# Altium project PCB_4550_Project.PrjPCB
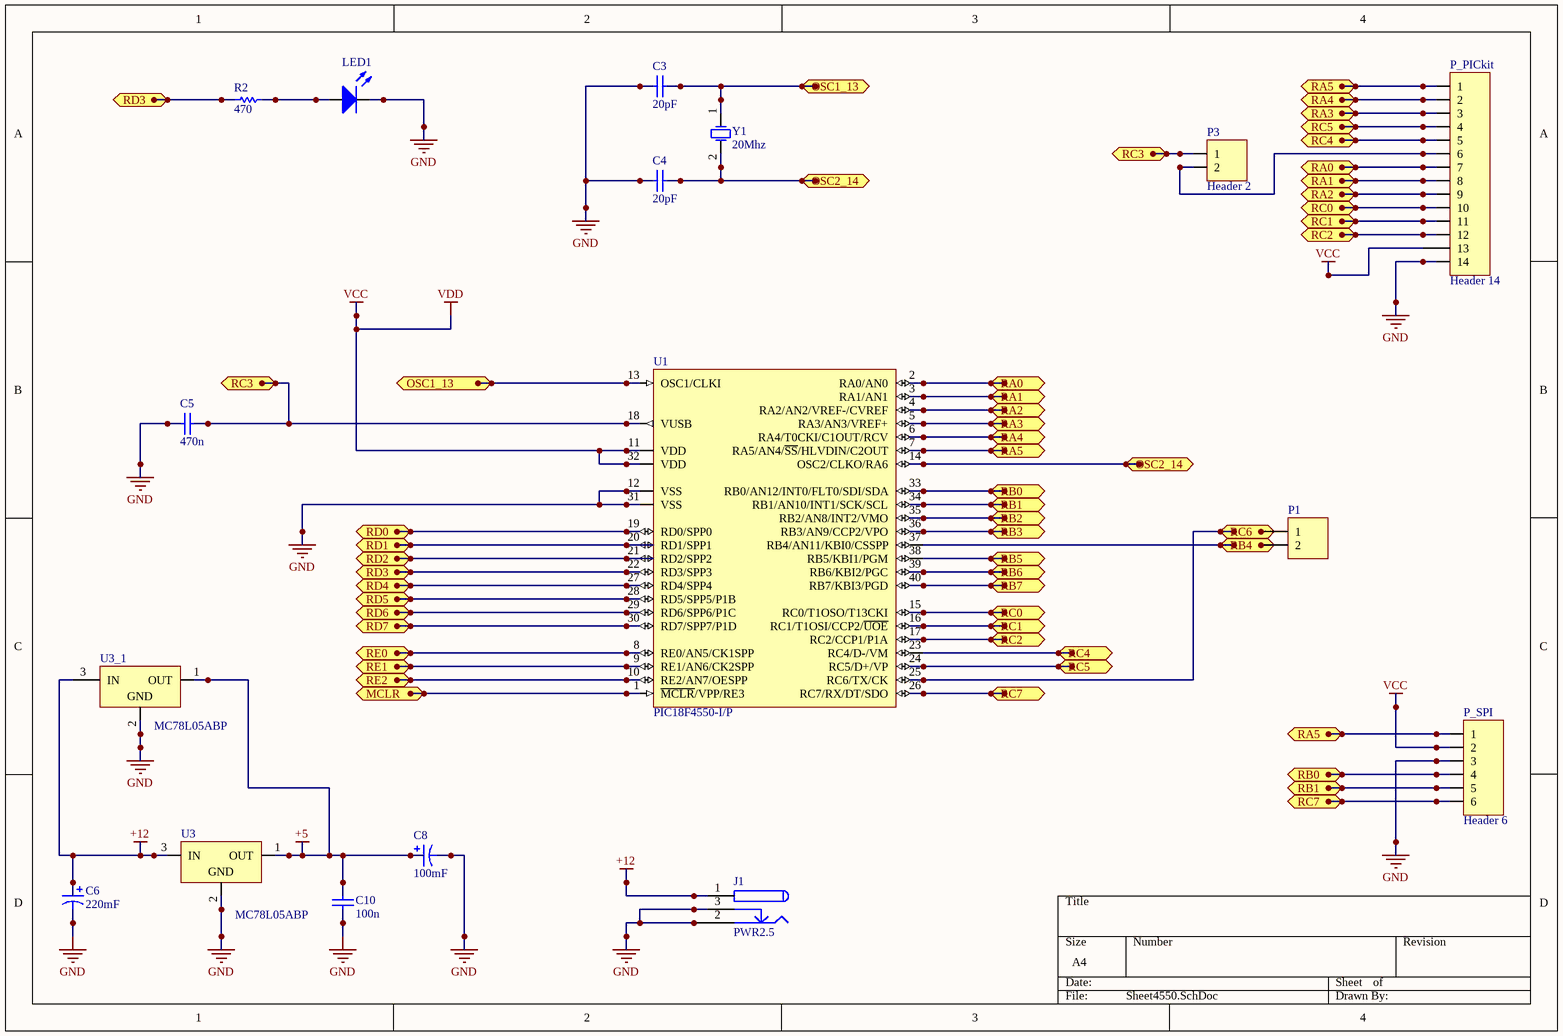
[diagram p0: Sheet4550.SchDoc]
1 sheet, 17 parts. Net scope: flat (ports and power ports of the same name join across sheets).
Board file: PCB_4550.PcbDoc

## Sheet Sheet4550.SchDoc
size A4

### Parts
C3  20pF  [CAPC2012L]
C4  20pF  [CAPC2012L]
C5  470n  [CAPC2012L]
C6  220mF  [CAPPR5-10x12.5]
C8  100mF  [CAPC5764L]
C10  100n  [CAPC2012L]
J1  PWR2.5  [KLD-0202]
LED1  LED2  [CAPC2012L]  (value not drawn)
P1  Header 2  [HDR1X2]  (value not drawn)
P3  Header 2  [HDR1X2]
P_PICkit  Header 14  [HDR1X14]
P_SPI  Header 6  [HDR1X6]
R2  470  [RESC3216L]
U1  PIC18F4550-I/P  [PDIP600-P40]
U3  MC78L05ABP  [29-04]
U3_1  MC78L05ABP  [29-04]
Y1  20Mhz  [SPST-2]

### Ports
MCLR, OSC1_13, OSC2_14, OSC2_14 (bidir), RA0, RA1, RA2, RA3, RA4, RA5, RB0, RB1, RB2, RB3, RB4, RB5, RB6, RB7, RC0, RC1, RC2, RC3, RC4, RC5, RC6, RC7, RD0, RD1, RD2, RD3, RD4, RD5, RD6, RD7, RE0, RE1, RE2

### Nets
+5: C8.1 C10.2 U3.1(OUT) U3_1.1(OUT)
+12: C6.1 J1.1 J1.1A J1.1B U3.3(IN) U3_1.3(IN)
GND: C3.1 C4.1 C5.1 C6.2 C8.2 C10.1 J1.2 J1.2A J1.2B J1.3 J1.3A J1.3B LED1.2(K) P_PICkit.14 P_SPI.3 U1.12(VSS) U1.31(VSS) U3.2(GND) U3_1.2(GND)
VCC: P_PICkit.13 P_SPI.2 U1.11(VDD) U1.32(VDD)  [also labelled VDD]
NetC3_2: C3.2 U1.13(OSC1/CLKI) Y1.1(OSC1) ; port OSC1_13
NetC4_2: C4.2 U1.14(OSC2/CLKO/RA6) Y1.2(OSC2) ; port OSC2_14
NetC5_2: C5.2 P3.1 U1.18(VUSB) ; port RC3
NetLED1_1: LED1.1(A) R2.2
NetP3_2: P3.2 P_PICkit.6
NetP_PICkit_1: P_PICkit.1 P_SPI.1 U1.7(RA5/AN4/~{SS}/HLVDIN/C2OUT) ; port RA5
NetP_PICkit_2: P_PICkit.2 U1.6(RA4/T0CKI/C1OUT/RCV) ; port RA4
NetP_PICkit_3: P_PICkit.3 U1.5(RA3/AN3/VREF+) ; port RA3
NetP_PICkit_4: P_PICkit.4 U1.24(RC5/D+/VP) ; port RC5
NetP_PICkit_5: P_PICkit.5 U1.23(RC4/D-/VM) ; port RC4
NetP_PICkit_7: P_PICkit.7 U1.2(RA0/AN0) ; port RA0
NetP_PICkit_8: P_PICkit.8 U1.3(RA1/AN1) ; port RA1
NetP_PICkit_9: P_PICkit.9 U1.4(RA2/AN2/VREF-/CVREF) ; port RA2
NetP_PICkit_10: P_PICkit.10 U1.15(RC0/T1OSO/T13CKI) ; port RC0
NetP_PICkit_11: P_PICkit.11 U1.16(RC1/T1OSI/CCP2/~{UOE}) ; port RC1
NetP_PICkit_12: P_PICkit.12 U1.17(RC2/CCP1/P1A) ; port RC2
NetP_SPI_4: P_SPI.4 U1.33(RB0/AN12/INT0/FLT0/SDI/SDA) ; port RB0
NetP_SPI_5: P_SPI.5 U1.34(RB1/AN10/INT1/SCK/SCL) ; port RB1
NetP_SPI_6: P_SPI.6 U1.26(RC7/RX/DT/SDO) ; port RC7
NetR2_1: R2.1 U1.22(RD3/SPP3) ; port RD3
NetU1_1: U1.1(~{MCLR}/VPP/RE3) ; port MCLR
NetU1_8: U1.8(RE0/AN5/CK1SPP) ; port RE0
NetU1_9: U1.9(RE1/AN6/CK2SPP) ; port RE1
NetU1_10: U1.10(RE2/AN7/OESPP) ; port RE2
NetU1_19: U1.19(RD0/SPP0) ; port RD0
NetU1_20: U1.20(RD1/SPP1) ; port RD1
NetU1_21: U1.21(RD2/SPP2) ; port RD2
NetU1_25: U1.25(RC6/TX/CK) ; port RC6
NetU1_27: U1.27(RD4/SPP4) ; port RD4
NetU1_28: U1.28(RD5/SPP5/P1B) ; port RD5
NetU1_29: U1.29(RD6/SPP6/P1C) ; port RD6
NetU1_30: U1.30(RD7/SPP7/P1D) ; port RD7
NetU1_35: U1.35(RB2/AN8/INT2/VMO) ; port RB2
NetU1_36: U1.36(RB3/AN9/CCP2/VPO) ; port RB3
NetU1_37: U1.37(RB4/AN11/KBI0/CSSPP) ; port RB4
NetU1_38: U1.38(RB5/KBI1/PGM) ; port RB5
NetU1_39: U1.39(RB6/KBI2/PGC) ; port RB6
NetU1_40: U1.40(RB7/KBI3/PGD) ; port RB7

Not connected (* = marked no-connect by the designer): P1 1 2

### Library data of the parts
C3-C5 C10 = Cap Semi: Capacitor (Semiconductor SIM Model); Published: 8-Jun-2000; LatestRevisionDate: 29-May-2009; LatestRevisionNote: IPC-7351 Footprint Added.; PackageReference: C1206; Publisher: Altium Limited; PackageDescription: Chip Capacitor
  C3 C4: Value: 20pF
  C5: Value: 470n
  C10: Value: 100n
C6 C8 = Cap Pol1: Polarized Capacitor (Radial); Published: 8-Jun-2000; LatestRevisionDate: 17-Jul-2002; LatestRevisionNote: Re-released for DXP Platform.; PackageReference: RB7.6-15; Publisher: Altium Limited
  C6: Value: 220mF
  C8: Value: 100mF
J1 = PWR2.5: DC Power Jack, 2.5mm, KLD Series, PCB Mount; Published: 5-Jan-2004; DatasheetDocument: 09-May-2002; Publisher: Altium Limited
LED1 = LED2: Typical RED, GREEN, YELLOW, AMBER GaAs LED; Published: 8-Jun-2000; LatestRevisionDate: 17-Jul-2002; LatestRevisionNote: Re-released for DXP Platform.; PackageReference: 3.2X1.6X1.1; Publisher: Altium Limited; PackageVersion: Feb-2002
P1 P3 = Header 2: Header, 2-Pin; LatestRevisionDate: 17-Jul-2002; LatestRevisionNote: Re-released for DXP Platform.; Publisher: Altium Limited
P_PICkit = Header 14: Header, 14-Pin; LatestRevisionDate: 17-Jul-2002; LatestRevisionNote: Re-released for DXP Platform.; Publisher: Altium Limited
P_SPI = Header 6: Header, 6-Pin; LatestRevisionDate: 17-Jul-2002; LatestRevisionNote: Re-released for DXP Platform.; Publisher: Altium Limited
R2 = Res Semi: Semiconductor Resistor; Published: 8-Jun-2000; LatestRevisionDate: 17-Jul-2002; LatestRevisionNote: Re-released for DXP Platform.; PackageReference: AXIAL-0.5; Publisher: Altium Limited; Value: 470
U1 = PIC18F4550-I/P: High Performance, Enhanced Flash, USB Microcontroller with nanoWatt Technology, 32K Flash, 40-Pin PDIP, Industrial Temperature Range; FirstPublished: 29-Jan-2009; LatestRevisionDate: 02-Dec-2009; LatestRevisionNote: Updated to datasheet revision E, Aug-2008; DatasheetVersion: revE, Aug-2008; PackageVersion: revBB, Aug-2009; PackageReference: PDIP600-P40; Publisher: Altium Limited; PackageDescription: 40-Lead Plastic Dual In-Line (P) - 600 mil Body [PDIP]; Supplier 1: Digi-Key; Supplier Part Number 1: PIC18F4550-I/P-ND; Supplier 2: Farnell; Supplier Part Number 2: 1660062; Supplier 3: Farnell; Supplier Part Number 3: 9321357; Supplier 4: Newark; Supplier Part Number 4: 74K8623; ComponentLink1Description: Datasheet; ComponentLink1URL: http://ww1.microchip.com/downloads/en/DeviceDoc/39632e.pdf; ComponentLink2Description: Packaging Specification; ComponentLink2URL: http://www.microchip.com/stellent/groups/techpub_sg/documents/packagingspec/en012702.pdf; ComponentLink3Description: Microchip.com Home; ComponentLink3URL: http://www.microchip.com/
U3 U3_1 = MC78L05ABP: Three-Terminal Low Current Positive Voltage Regulator; Published: 15-Apr-2002; DatasheetVersion: Oct-1999; PackageVersion: 1996; PackageReference: 29-04; Publisher: Altium Limited; PackageDescription: TO, Flat Index; 3 In-Line, Axial Leads; Body Dia. 4.8mm; Leads 0.48 x 0.51 mm (max); ComponentLink1Description: Manufacturer Link; ComponentLink1URL: http://www.onsemi.com/site/products/taxonomy/0,4438,503,00.html; ComponentLink2Description: Datasheet; ComponentLink2URL: http://www.onsemi.com/pub/Collateral/MC78L00A-D.PDF
Y1 = XTAL: Crystal Oscillator; Published: 8-Jun-2000; LatestRevisionDate: 17-Jul-2002; LatestRevisionNote: Re-released for DXP Platform.; PackageReference: R38; Publisher: Altium Limited